# EAGLE schematic PCB Tester Board rev1 (EAGLE 9.6.2)

## Sheet 1 of 5: General
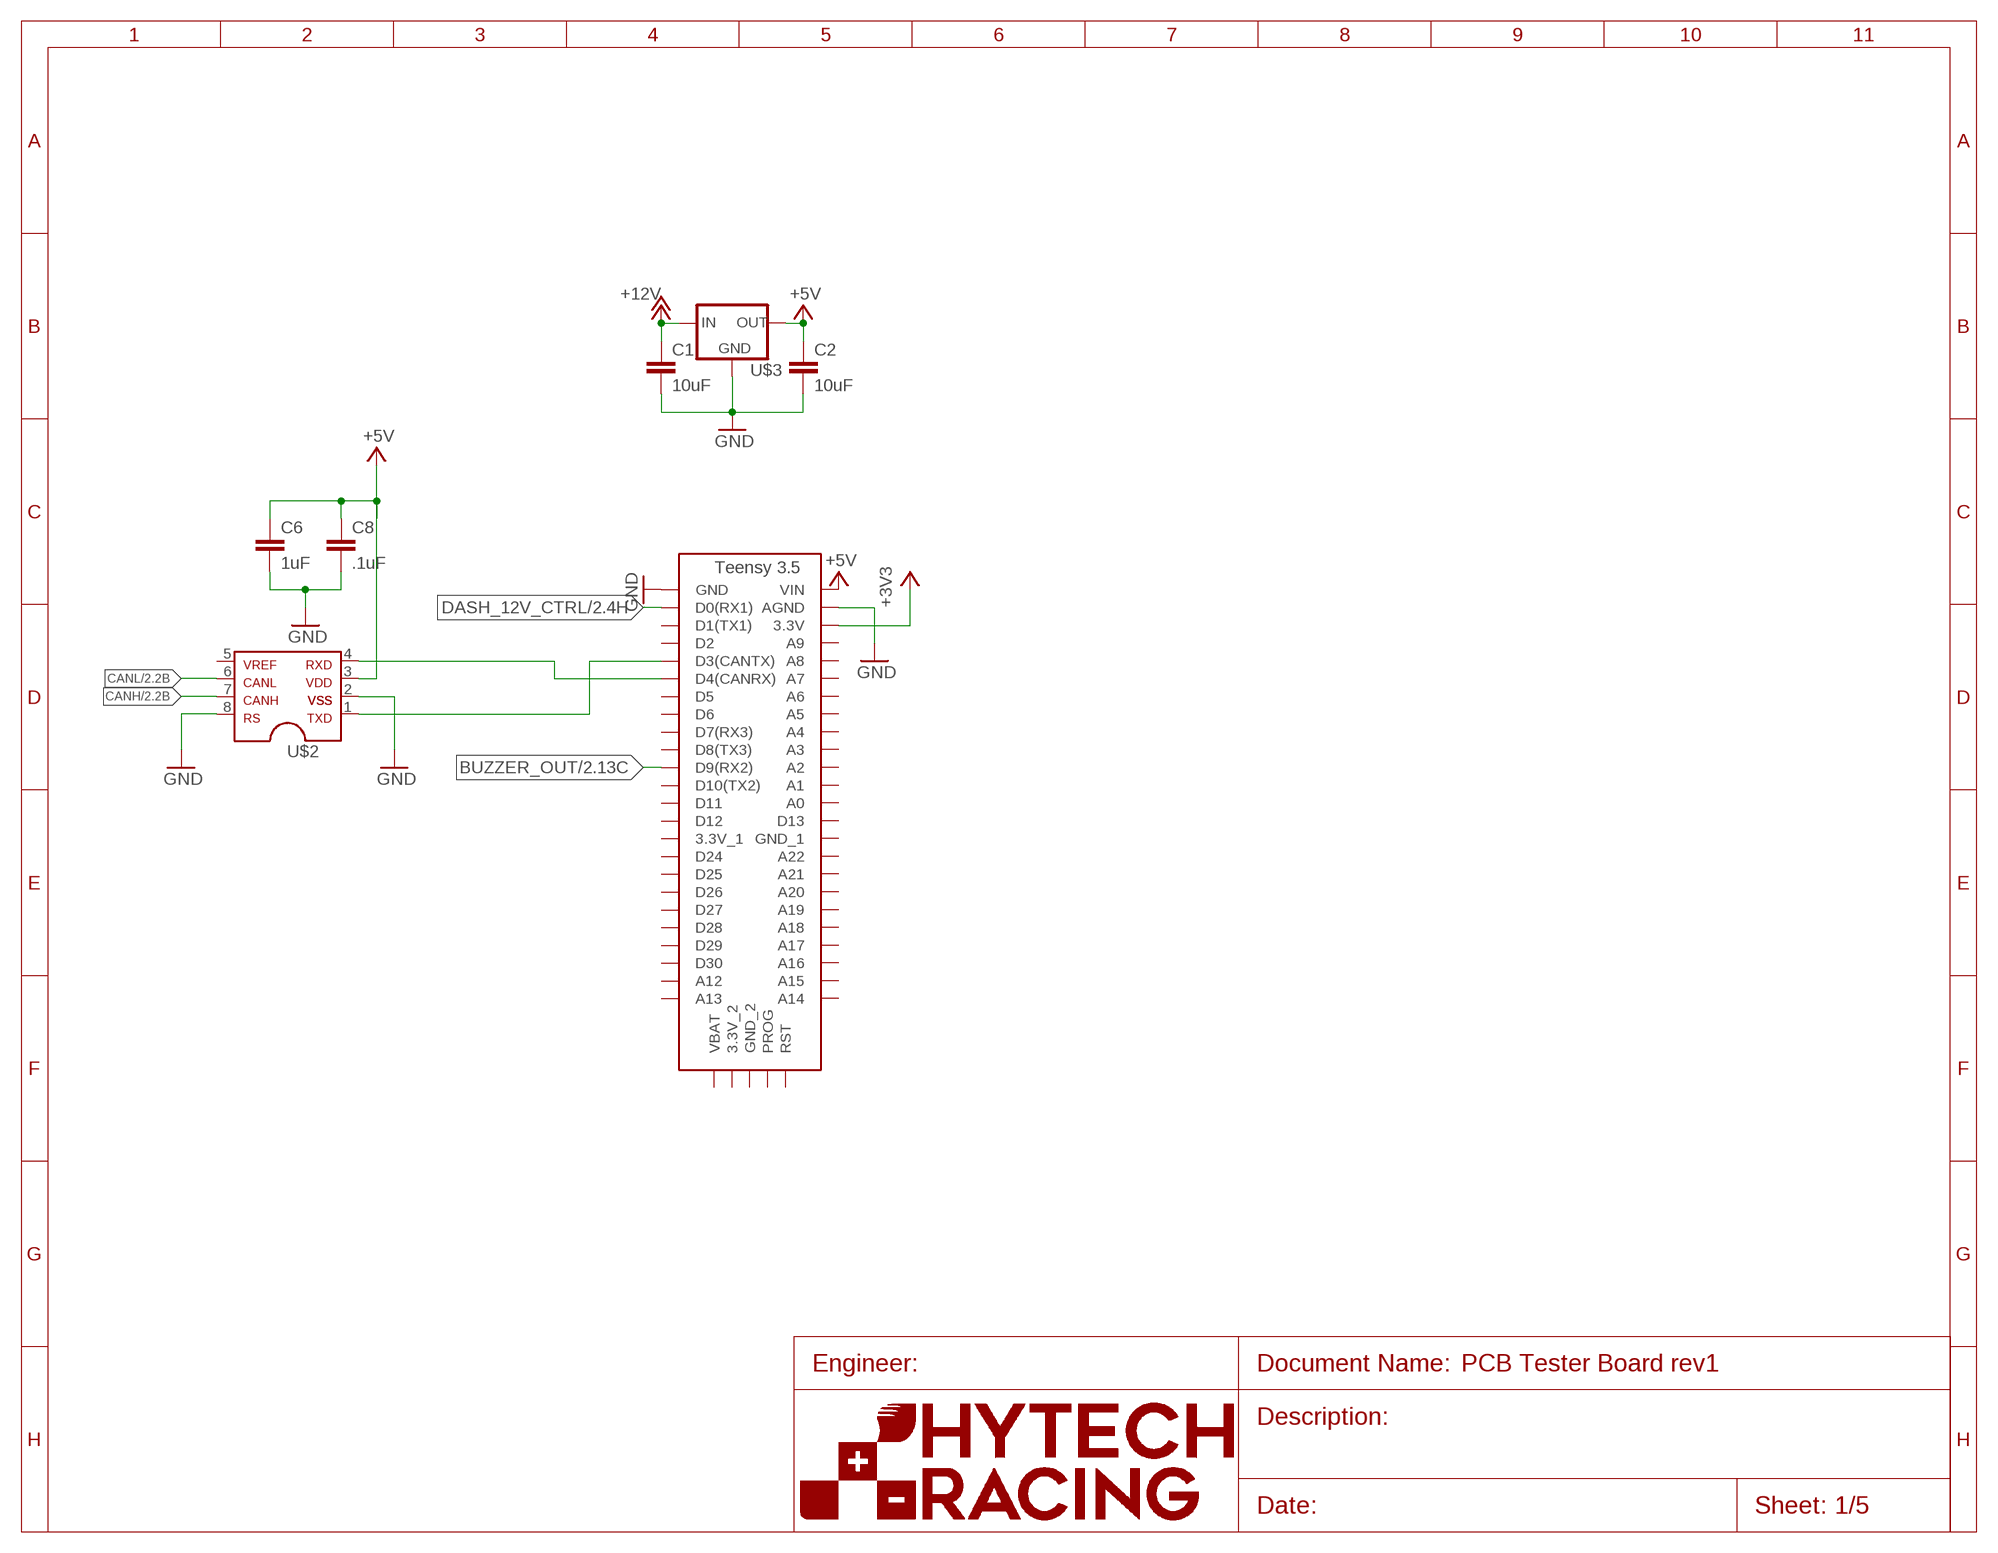
[diagram p0: schematic, sheet 1]
U$17 (FRAME_A): FRAME_DESCRIPTION: Default; ORIENTATION: LANDSCAPE; SIZE: A

### Parts
C1  10uF  CAP0603-CAP  [0603-CAP]
C2  10uF  CAP0603-CAP  [0603-CAP]
C6  1uF  CAP0603-CAP  [0603-CAP]
C8  .1uF  CAP0603-CAP  [0603-CAP]
U$2  MCP2551  [SOIC-08]
U$3  OKI-78SR-5  [OKI-78SR]
U$10  TEENSY_3.5_EXT  [TEENSY_3.5_EXT]

### Nets
+3V3: U$10.3.3V ; also sheet 2,3,4
+5V: C2.1 C6.1 C8.1 U$2.3 U$3.3(OUT) U$10.VIN ; also sheet 3,4
+12V: C1.1 U$3.1(IN) ; also sheet 2,3,4
BUZZER_OUT: U$10.D9(RX2) ; also sheet 2
CANH: U$2.7 ; also sheet 2,4
CANL: U$2.6 ; also sheet 2,4
DASH_12V_CTRL: U$10.D0(RX1) ; also sheet 2
GND: C1.2 C2.2 C6.2 C8.2 U$2.2 U$2.8 U$3.2(GND) U$10.AGND U$10.GND ; also sheet 2,3,4
N$9: U$2.1 U$10.D3(CANTX)
N$10: U$2.4 U$10.D4(CANRX)
Unconnected: U$2.5 U$10.3.3V_1 U$10.3.3V_2 U$10.A0 U$10.A1 U$10.A2 U$10.A3 U$10.A4 U$10.A5 U$10.A6 U$10.A7 U$10.A8 U$10.A9 U$10.A12 U$10.A13 U$10.A14 U$10.A15 U$10.A16 U$10.A17 U$10.A18 U$10.A19 U$10.A20 U$10.A21 U$10.A22 U$10.D1(TX1) U$10.D2 U$10.D5 U$10.D6 U$10.D7(RX3) U$10.D8(TX3) U$10.D10(TX2) U$10.D11 U$10.D12 U$10.D13 U$10.D24 U$10.D25 U$10.D26 U$10.D27 U$10.D28 U$10.D29 U$10.D30 U$10.GND_1 U$10.GND_2 U$10.PROG U$10.RST U$10.VBAT

## Sheet 2 of 5: Dashboard
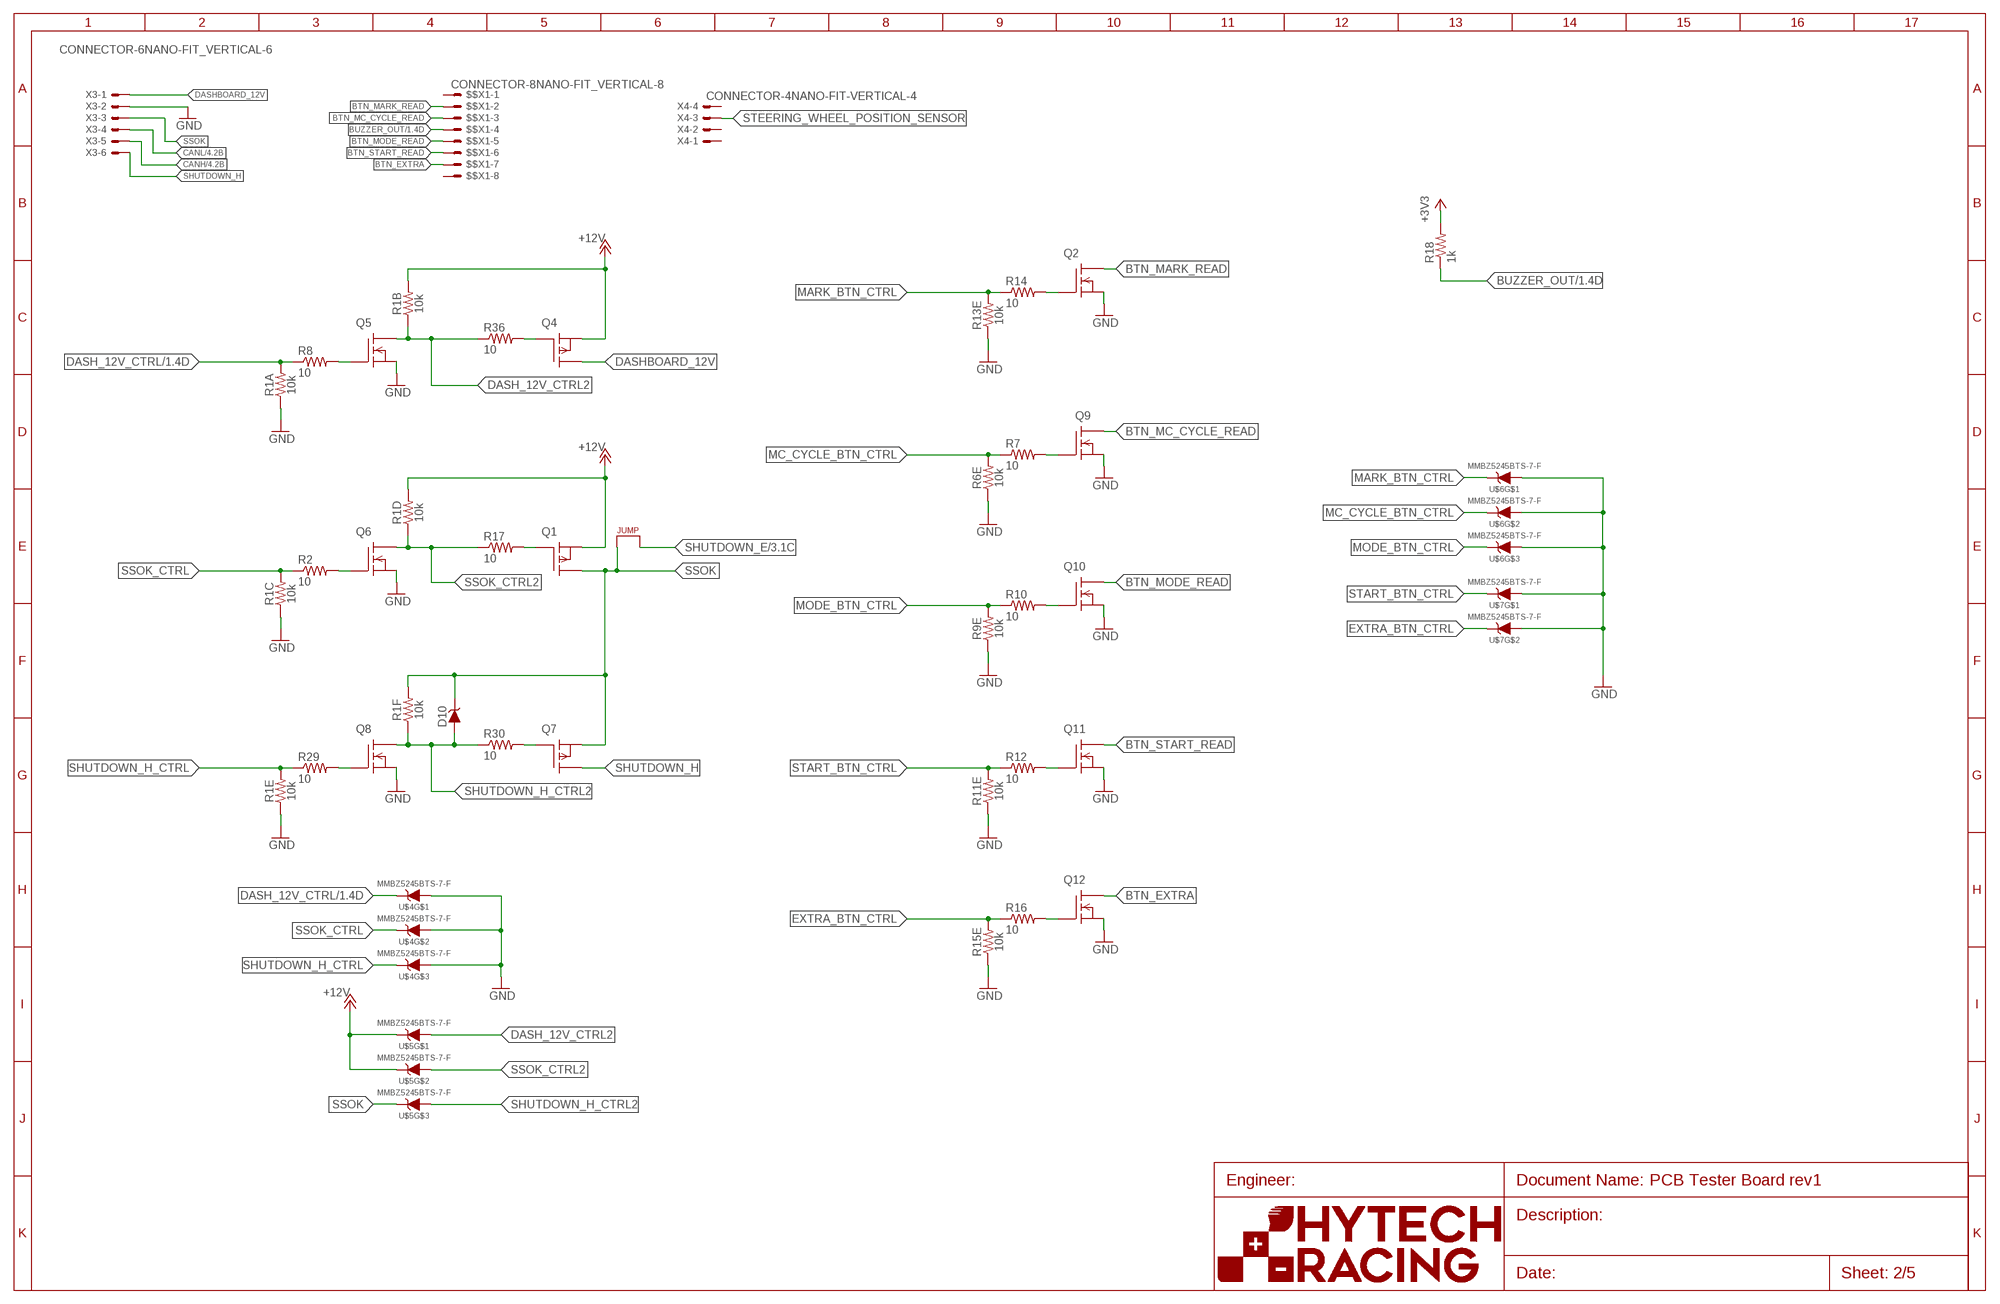
[diagram p1: schematic, sheet 2]
U$14 (FRAME_B): FRAME_DESCRIPTION: Default; ORIENTATION: LANDSCAPE; SIZE: B

### Parts
$$X1  CONNECTOR-8NANO-FIT_VERTICAL-8  [NANO-FIT_VERTICAL-8]
D10  DIODE_ZENER  [SOT23]
J4  JUMPER.1  [1X02]
Q1  P-CHANNEL_MOSFET_DMP3099L-7  [SOT23]
Q2  DMG3406LSOT  [SOT23]
Q4  P-CHANNEL_MOSFET_DMP3099L-7  [SOT23]
Q5  DMG3406LSOT  [SOT23]
Q6  DMG3406LSOT  [SOT23]
Q7  P-CHANNEL_MOSFET_DMP3099L-7  [SOT23]
Q8  DMG3406LSOT  [SOT23]
Q9  DMG3406LSOT  [SOT23]
Q10  DMG3406LSOT  [SOT23]
Q11  DMG3406LSOT  [SOT23]
Q12  DMG3406LSOT  [SOT23]
R1  10k  YC248-JR-0710KL  [YAG_YC248-M]
R2  10  RESISTOR0603  [0603-RES]
R6  10k  YC248-JR-0710KL  [YAG_YC248-M]
R7  10  RESISTOR0603  [0603-RES]
R8  10  RESISTOR0603  [0603-RES]
R9  10k  YC248-JR-0710KL  [YAG_YC248-M]
R10  10  RESISTOR0603  [0603-RES]
R11  10k  YC248-JR-0710KL  [YAG_YC248-M]
R12  10  RESISTOR0603  [0603-RES]
R13  10k  YC248-JR-0710KL  [YAG_YC248-M]
R14  10  RESISTOR0603  [0603-RES]
R15  10k  YC248-JR-0710KL  [YAG_YC248-M]
R16  10  RESISTOR0603  [0603-RES]
R17  10  RESISTOR0603  [0603-RES]
R18  1k  RESISTOR0603  [0603-RES]
R29  10  RESISTOR0603  [0603-RES]
R30  10  RESISTOR0603  [0603-RES]
R36  10  RESISTOR0603  [0603-RES]
U$4  MMBZ5245BTS-7-F  [SOT363]
U$5  MMBZ5245BTS-7-F  [SOT363]
U$6  MMBZ5245BTS-7-F  [SOT363]
U$7  MMBZ5245BTS-7-F  [SOT363]
X3  CONNECTOR-6NANO-FIT_VERTICAL-6  [NANO-FIT_VERTICAL-6]
X4  CONNECTOR-4NANO-FIT-VERTICAL-4  [NANO-FIT_VERTICAL-4]

### Nets
+3V3: R18.2 ; also sheet 1,3,4
+12V: Q1.2(S) Q4.2(S) R1.13 R1.15 U$5.P$4(C) U$5.P$5(C) ; also sheet 1,3,4
BTN_EXTRA: $$X1.P$7 Q12.3(D)
BTN_MARK_READ: $$X1.P$2 Q2.3(D)
BTN_MC_CYCLE_READ: $$X1.P$3 Q9.3(D)
BTN_MODE_READ: $$X1.P$5 Q10.3(D)
BTN_START_READ: $$X1.P$6 Q11.3(D)
BUZZER_OUT: $$X1.P$4 R18.1 ; also sheet 1
CANH: X3.P$5 ; also sheet 1,4
CANL: X3.P$4 ; also sheet 1,4
DASH_12V_CTRL: R1.16 R8.1 U$4.P$4(C) ; also sheet 1
DASH_12V_CTRL2: Q5.3(D) R1.2 R36.1 U$5.P$1(A)
DASHBOARD_12V: Q4.3(D) X3.P$1
EXTRA_BTN_CTRL: R15.12 R16.1 U$7.P$5(C)
GND: Q2.2(S) Q5.2(S) Q6.2(S) Q8.2(S) Q9.2(S) Q10.2(S) Q11.2(S) Q12.2(S) R1.1 R1.3 R1.5 R6.5 R9.5 R11.5 R13.5 R15.5 U$4.P$1(A) U$4.P$2(A) U$4.P$3(A) U$6.P$1(A) U$6.P$2(A) U$6.P$3(A) U$7.P$1(A) U$7.P$2(A) X3.P$2 ; also sheet 1,3,4
MARK_BTN_CTRL: R13.12 R14.1 U$6.P$4(C)
MC_CYCLE_BTN_CTRL: R6.12 R7.1 U$6.P$5(C)
MODE_BTN_CTRL: R9.12 R10.1 U$6.P$6(C)
N$4: Q9.1(G) R7.2
N$5: Q10.1(G) R10.2
N$6: Q11.1(G) R12.2
N$7: Q5.1(G) R8.2
N$8: Q12.1(G) R16.2
N$13: Q2.1(G) R14.2
N$26: Q6.1(G) R2.2
N$27: Q1.1(G) R17.2
N$29: Q8.1(G) R29.2
N$30: Q7.1(G) R30.2
N$34: Q4.1(G) R36.2
SHUTDOWN_E: J4.2 ; also sheet 3
SHUTDOWN_H: Q7.3(D) X3.P$6
SHUTDOWN_H_CTRL: R1.12 R29.1 U$4.P$6(C)
SHUTDOWN_H_CTRL2: D10.1(A) Q8.3(D) R1.6 R30.1 U$5.P$3(A)
SSOK: D10.3(C) J4.1 Q1.3(D) Q7.2(S) R1.11 U$5.P$6(C) X3.P$3
SSOK_CTRL: R1.14 R2.1 U$4.P$5(C)
SSOK_CTRL2: Q6.3(D) R1.4 R17.1 U$5.P$2(A)
START_BTN_CTRL: R11.12 R12.1 U$7.P$4(C)
STEERING_WHEEL_POSITION_SENSOR: X4.P$3
Unconnected: $$X1.P$1 $$X1.P$8 R1.7 R1.8 R1.9 R1.10 R6.1 R6.2 R6.3 R6.4 R6.6 R6.7 R6.8 R6.9 R6.10 R6.11 R6.13 R6.14 R6.15 R6.16 R9.1 R9.2 R9.3 R9.4 R9.6 R9.7 R9.8 R9.9 R9.10 R9.11 R9.13 R9.14 R9.15 R9.16 R11.1 R11.2 R11.3 R11.4 R11.6 R11.7 R11.8 R11.9 R11.10 R11.11 R11.13 R11.14 R11.15 R11.16 R13.1 R13.2 R13.3 R13.4 R13.6 R13.7 R13.8 R13.9 R13.10 R13.11 R13.13 R13.14 R13.15 R13.16 R15.1 R15.2 R15.3 R15.4 R15.6 R15.7 R15.8 R15.9 R15.10 R15.11 R15.13 R15.14 R15.15 R15.16 U$7.P$3(A) U$7.P$6(C) X4.P$1 X4.P$2 X4.P$4

## Sheet 3 of 5: Main ECU Sheet
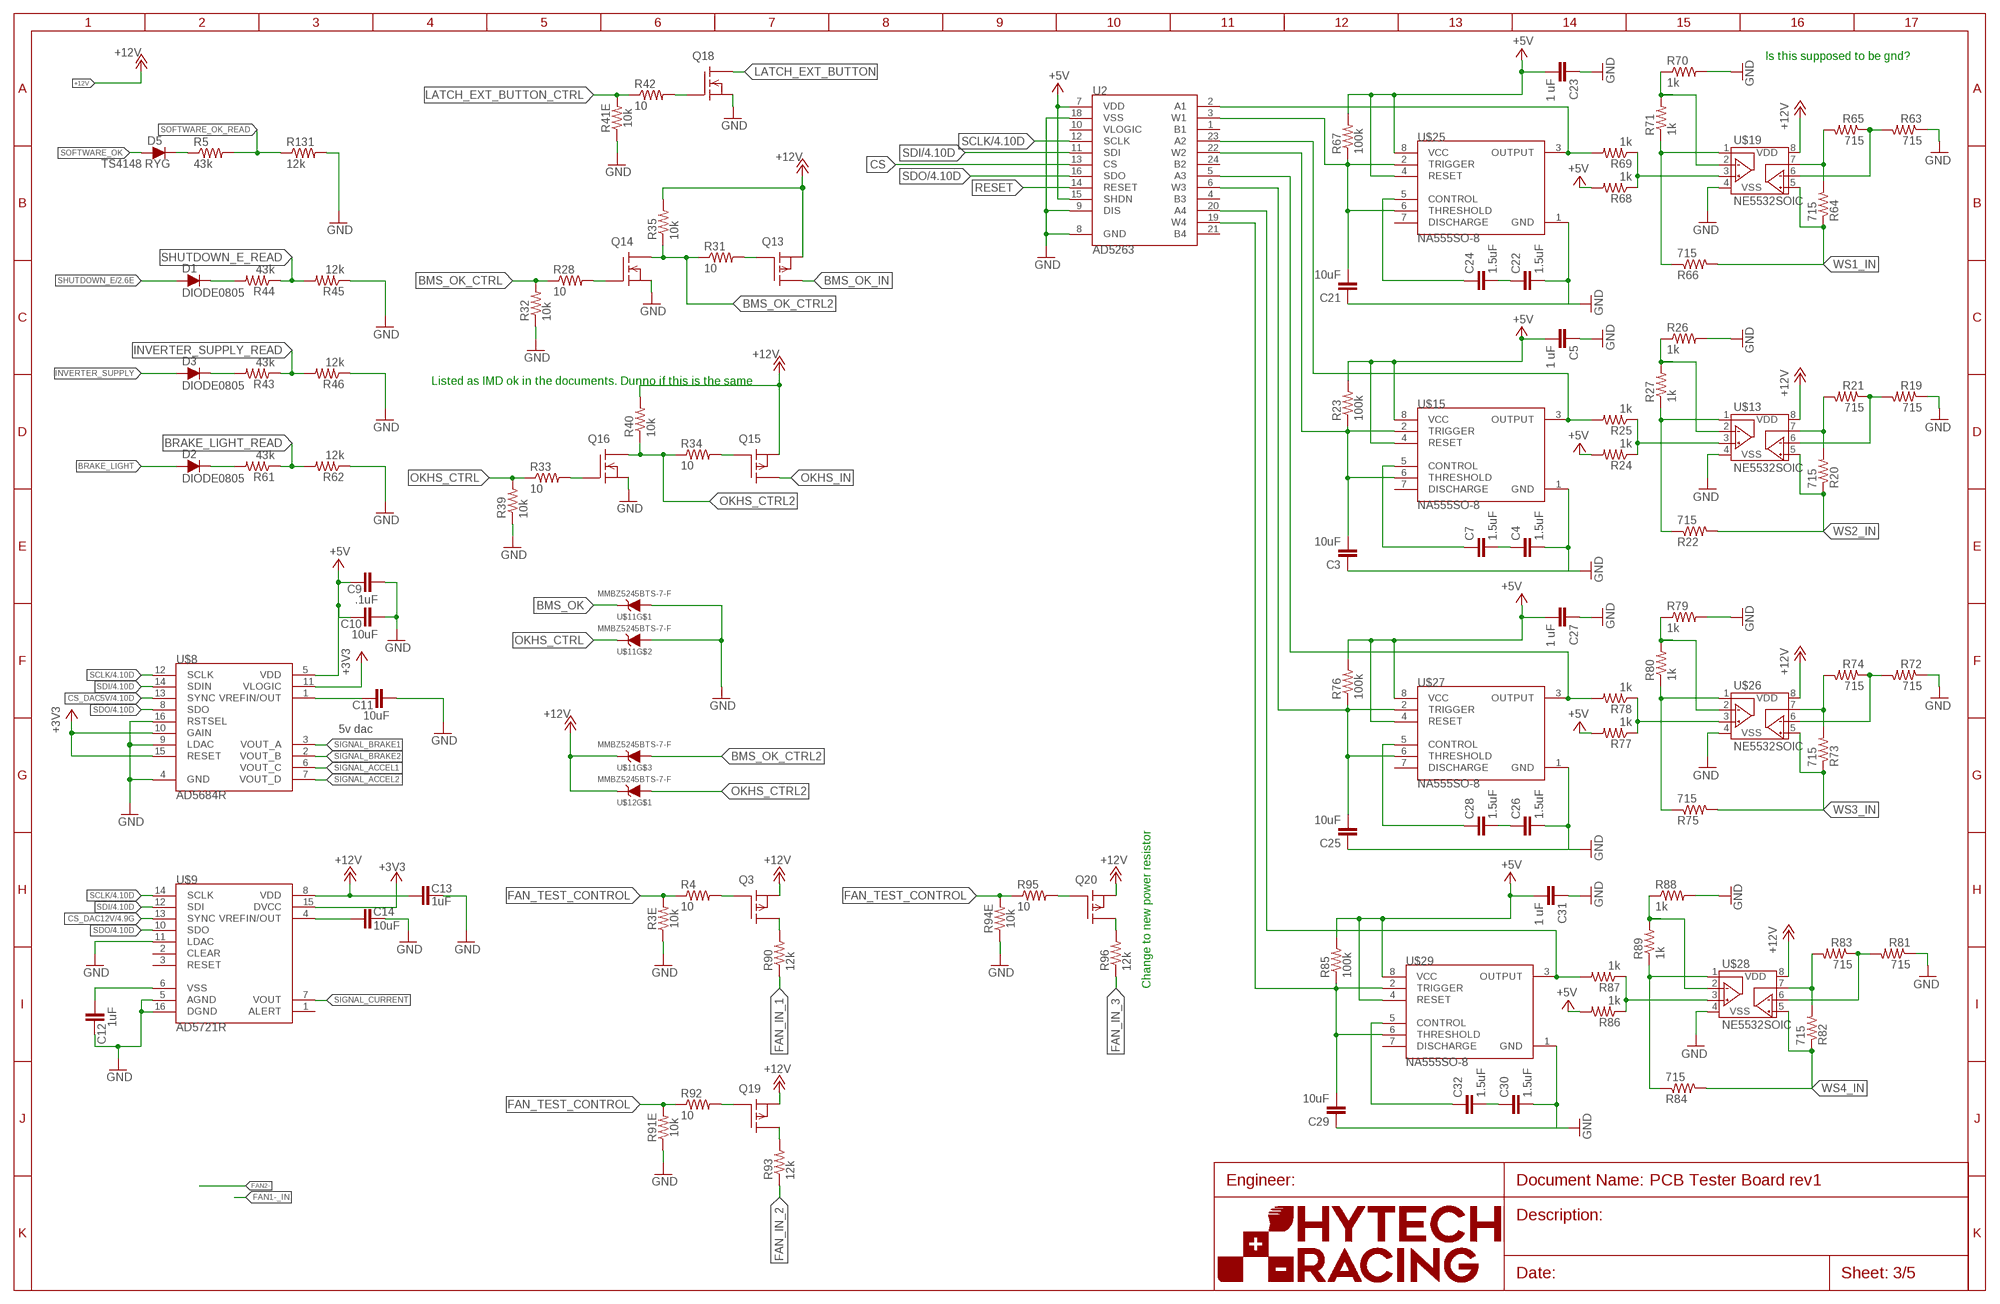
[diagram p2: schematic, sheet 3]
U$1 (FRAME_B): FRAME_DESCRIPTION: Default; ORIENTATION: LANDSCAPE; SIZE: B

### Parts
C3  10uF  CAP0603-CAP  [0603-CAP]
C4  1.5uF  CAP0603-CAP  [0603-CAP]
C5  1 uF  CAP0603-CAP  [0603-CAP]
C7  1.5uF  CAP0603-CAP  [0603-CAP]
C9  .1uF  CAP0603-CAP  [0603-CAP]
C10  10uF  CAP0603-CAP  [0603-CAP]
C11  10uF  CAP0603-CAP  [0603-CAP]
C12  1uF  CAP0603-CAP  [0603-CAP]
C13  1uF  CAP0603-CAP  [0603-CAP]
C14  10uF  CAP0603-CAP  [0603-CAP]
C21  10uF  CAP0603-CAP  [0603-CAP]
C22  1.5uF  CAP0603-CAP  [0603-CAP]
C23  1 uF  CAP0603-CAP  [0603-CAP]
C24  1.5uF  CAP0603-CAP  [0603-CAP]
C25  10uF  CAP0603-CAP  [0603-CAP]
C26  1.5uF  CAP0603-CAP  [0603-CAP]
C27  1 uF  CAP0603-CAP  [0603-CAP]
C28  1.5uF  CAP0603-CAP  [0603-CAP]
C29  10uF  CAP0603-CAP  [0603-CAP]
C30  1.5uF  CAP0603-CAP  [0603-CAP]
C31  1 uF  CAP0603-CAP  [0603-CAP]
C32  1.5uF  CAP0603-CAP  [0603-CAP]
D1  DIODE0805  [0805_D]
D2  DIODE0805  [0805_D]
D3  DIODE0805  [0805_D]
D5  TS4148 RYG  DIODE0805  [0805_D]
Q3  P-CHANNEL_MOSFET_DMP3099L-7  [SOT23]
Q13  P-CHANNEL_MOSFET_DMP3099L-7  [SOT23]
Q14  DMG3406LSOT  [SOT23]
Q15  P-CHANNEL_MOSFET_DMP3099L-7  [SOT23]
Q16  DMG3406LSOT  [SOT23]
Q18  DMG3406LSOT  [SOT23]
Q19  P-CHANNEL_MOSFET_DMP3099L-7  [SOT23]
Q20  P-CHANNEL_MOSFET_DMP3099L-7  [SOT23]
R3  10k  YC248-JR-0710KL  [YAG_YC248-M]
R4  10  RESISTOR0603  [0603-RES]
R5  43k  RESISTOR0603  [0603-RES]
R19  715  RESISTOR0603  [0603-RES]
R20  715  RESISTOR0603  [0603-RES]
R21  715  RESISTOR0603  [0603-RES]
R22  715  RESISTOR0603  [0603-RES]
R23  100k  RESISTOR0603  [0603-RES]
R24  1k  RESISTOR0603  [0603-RES]
R25  1k  RESISTOR0603  [0603-RES]
R26  1k  RESISTOR0603  [0603-RES]
R27  1k  RESISTOR0603  [0603-RES]
R28  10  RESISTOR0603  [0603-RES]
R31  10  RESISTOR0603  [0603-RES]
R32  10k  RESISTOR0603  [0603-RES]
R33  10  RESISTOR0603  [0603-RES]
R34  10  RESISTOR0603  [0603-RES]
R35  10k  RESISTOR0603  [0603-RES]
R39  10k  RESISTOR0603  [0603-RES]
R40  10k  RESISTOR0603  [0603-RES]
R41  10k  YC248-JR-0710KL  [YAG_YC248-M]
R42  10  RESISTOR0603  [0603-RES]
R43  43k  RESISTOR0603  [0603-RES]
R44  43k  RESISTOR0603  [0603-RES]
R45  12k  RESISTOR0603  [0603-RES]
R46  12k  RESISTOR0603  [0603-RES]
R61  43k  RESISTOR0603  [0603-RES]
R62  12k  RESISTOR0603  [0603-RES]
R63  715  RESISTOR0603  [0603-RES]
R64  715  RESISTOR0603  [0603-RES]
R65  715  RESISTOR0603  [0603-RES]
R66  715  RESISTOR0603  [0603-RES]
R67  100k  RESISTOR0603  [0603-RES]
R68  1k  RESISTOR0603  [0603-RES]
R69  1k  RESISTOR0603  [0603-RES]
R70  1k  RESISTOR0603  [0603-RES]
R71  1k  RESISTOR0603  [0603-RES]
R72  715  RESISTOR0603  [0603-RES]
R73  715  RESISTOR0603  [0603-RES]
R74  715  RESISTOR0603  [0603-RES]
R75  715  RESISTOR0603  [0603-RES]
R76  100k  RESISTOR0603  [0603-RES]
R77  1k  RESISTOR0603  [0603-RES]
R78  1k  RESISTOR0603  [0603-RES]
R79  1k  RESISTOR0603  [0603-RES]
R80  1k  RESISTOR0603  [0603-RES]
R81  715  RESISTOR0603  [0603-RES]
R82  715  RESISTOR0603  [0603-RES]
R83  715  RESISTOR0603  [0603-RES]
R84  715  RESISTOR0603  [0603-RES]
R85  100k  RESISTOR0603  [0603-RES]
R86  1k  RESISTOR0603  [0603-RES]
R87  1k  RESISTOR0603  [0603-RES]
R88  1k  RESISTOR0603  [0603-RES]
R89  1k  RESISTOR0603  [0603-RES]
R90  12k  RESISTOR10W  [10W_RESISTOR_VISHAY]
R91  10k  YC248-JR-0710KL  [YAG_YC248-M]
R92  10  RESISTOR0603  [0603-RES]
R93  12k  RESISTOR10W  [10W_RESISTOR_VISHAY]
R94  10k  YC248-JR-0710KL  [YAG_YC248-M]
R95  10  RESISTOR0603  [0603-RES]
R96  12k  RESISTOR10W  [10W_RESISTOR_VISHAY]
R131  12k  RESISTOR0603  [0603-RES]
U2  AD5263  [TSSOP-24]
U$8  AD5684R  [TSSOP-16]
U$9  AD5721R  [TSSOP-16]
U$11  MMBZ5245BTS-7-F  [SOT363]
U$12  MMBZ5245BTS-7-F  [SOT363]
U$13  NE5532SOIC  [SOIC-08]
U$15  NA555SO-8  [SOIC-08]
U$19  NE5532SOIC  [SOIC-08]
U$25  NA555SO-8  [SOIC-08]
U$26  NE5532SOIC  [SOIC-08]
U$27  NA555SO-8  [SOIC-08]
U$28  NE5532SOIC  [SOIC-08]
U$29  NA555SO-8  [SOIC-08]

### Nets
555_GND: C3.1 C4.2 C21.1 C22.2 C25.1 C26.2 C29.1 C30.2 U$15.1(GND) U$25.1(GND) U$27.1(GND) U$29.1(GND) ; supply symbol labelled GND
+3V3: U$8.10(GAIN) U$8.11(VLOGIC) U$8.15(RESET) U$9.15(DVCC) ; also sheet 1,2,4
+5V: C5.2 C9.1 C10.1 C23.2 C27.2 C31.2 R23.2 R24.2 R67.2 R68.2 R76.2 R77.2 R85.2 R86.2 U2.7(VDD) U2.15(SHDN) U$8.5(VDD) U$15.4(RESET) U$15.8(VCC) U$25.4(RESET) U$25.8(VCC) U$27.4(RESET) U$27.8(VCC) U$29.4(RESET) U$29.8(VCC) ; also sheet 1,4
+12V: C13.2 Q3.2(S) Q13.2(S) Q15.2(S) Q19.2(S) Q20.2(S) R35.2 R40.2 U$9.8(VDD) U$11.P$6(C) U$12.P$4(C) U$13.8(VDD) U$19.8(VDD) U$26.8(VDD) U$28.8(VDD) ; also sheet 1,2,4
ALTERNATINGVOLTAGE1: R66.1 R71.1 U$19.1(VOUTA)
ALTERNATINGVOLTAGE2: R22.1 R27.1 U$13.1(VOUTA)
ALTERNATINGVOLTAGE3: R75.1 R80.1 U$26.1(VOUTA)
ALTERNATINGVOLTAGE4: R84.1 R89.1 U$28.1(VOUTA)
BMS_OK: U$11.P$4(C)
BMS_OK_CTRL: R28.1 R32.2
BMS_OK_CTRL2: Q14.3(D) R31.1 R35.1 U$11.P$3(A)
BMS_OK_IN: Q13.3(D)
BRAKE_LIGHT: D2.A
BRAKE_LIGHT_READ: R61.1 R62.2
CS: U2.13(CS)
CS_DAC5V: U$8.13(SYNC) ; also sheet 4
CS_DAC12V: U$9.13(SYNC) ; also sheet 4
FAN_IN_1: R90.1
FAN_IN_2: R93.1
FAN_IN_3: R96.1
FAN_TEST_CONTROL: R3.12 R4.1 R91.12 R92.1 R94.12 R95.1
GND: C5.1 C9.2 C10.2 C11.2 C12.1 C13.1 C14.1 C23.1 C27.1 C31.1 Q14.2(S) Q16.2(S) Q18.2(S) R3.5 R19.1 R26.2 R32.1 R39.1 R41.5 R45.1 R46.1 R62.1 R63.1 R70.2 R72.1 R79.2 R81.1 R88.2 R91.5 R94.5 R131.2 U2.8(GND) U2.9(DIS) U2.18(VSS) U$8.4(GND) U$8.9(LDAC) U$8.16(RSTSEL) U$9.5(AGND) U$9.11(LDAC) U$9.16(DGND) U$11.P$1(A) U$11.P$2(A) U$13.4(VSS) U$19.4(VSS) U$26.4(VSS) U$28.4(VSS) ; also sheet 1,2,4
INVERTER_SUPPLY: D3.A
INVERTER_SUPPLY_READ: R43.1 R46.2
LATCH_EXT_BUTTON: Q18.3(D)
LATCH_EXT_BUTTON_CTRL: R41.12 R42.1
N$1: Q3.1(G) R4.2
N$2: C11.1 U$8.1(VREFIN/OUT)
N$3: D5.C R5.1
N$11: Q14.1(G) R28.2
N$12: Q13.1(G) R31.2
N$14: Q16.1(G) R33.2
N$15: Q15.1(G) R34.2
N$16: C12.2 U$9.6(VSS)
N$17: R69.2 U2.2(A1) U$25.3(OUTPUT)
N$18: R25.2 U2.23(A2) U$15.3(OUTPUT)
N$19: R24.1 R25.1 U$13.3(VINA+)
N$20: R20.2 R21.2 U$13.7(VOUTB)
N$21: R26.1 R27.2 U$13.2(VINA-)
N$22: C3.2 R23.1 U2.22(W2) U$15.2(TRIGGER) U$15.6(THRESHOLD)
N$23: C7.1 U$15.5(CONTROL)
N$25: C14.2 U$9.4(VREFIN/OUT)
N$28: C4.1 C7.2
N$33: R19.2 R21.1 U$13.6(VINB-)
N$51: D3.C R43.2
N$52: D1.C R44.2
N$53: D2.C R61.2
N$54: Q18.1(G) R42.2
N$55: R68.1 R69.1 U$19.3(VINA+)
N$56: R64.2 R65.2 U$19.7(VOUTB)
N$57: R70.1 R71.2 U$19.2(VINA-)
N$58: C21.2 R67.1 U2.3(W1) U$25.2(TRIGGER) U$25.6(THRESHOLD)
N$59: C24.1 U$25.5(CONTROL)
N$60: C22.1 C24.2
N$61: R63.2 R65.1 U$19.6(VINB-)
N$62: R78.2 U2.5(A3) U$27.3(OUTPUT)
N$63: R77.1 R78.1 U$26.3(VINA+)
N$64: R73.2 R74.2 U$26.7(VOUTB)
N$65: R79.1 R80.2 U$26.2(VINA-)
N$66: Q3.3(D) R90.2
N$67: C28.1 U$27.5(CONTROL)
N$68: C26.1 C28.2
N$69: R72.2 R74.1 U$26.6(VINB-)
N$70: R87.2 U2.20(A4) U$29.3(OUTPUT)
N$71: R86.1 R87.1 U$28.3(VINA+)
N$72: R82.2 R83.2 U$28.7(VOUTB)
N$73: R88.1 R89.2 U$28.2(VINA-)
N$74: C29.2 R85.1 U2.19(W4) U$29.2(TRIGGER) U$29.6(THRESHOLD)
N$75: C32.1 U$29.5(CONTROL)
N$76: C30.1 C32.2
N$77: R81.2 R83.1 U$28.6(VINB-)
N$78: Q19.1(G) R92.2
N$79: Q19.3(D) R93.2
N$80: Q20.1(G) R95.2
N$81: Q20.3(D) R96.2
N$82: C25.2 R76.1 U2.6(W3) U$27.2(TRIGGER) U$27.6(THRESHOLD)
OKHS_CTRL: R33.1 R39.2 U$11.P$5(C)
OKHS_CTRL2: Q16.3(D) R34.1 R40.1 U$12.P$1(A)
OKHS_IN: Q15.3(D)
RESET: U2.14(RESET)
SCLK: U2.12(SCLK) U$8.12(SCLK) U$9.14(SCLK) ; also sheet 4
SDI: U2.11(SDI) U$8.14(SDIN) U$9.12(SDI) ; also sheet 4
SDO: U2.16(SDO) U$8.8(SDO) U$9.10(SDO) ; also sheet 4
SHUTDOWN_E: D1.A ; also sheet 2
SHUTDOWN_E_READ: R44.1 R45.2
SIGNAL_ACCEL1: U$8.6(VOUT_C)
SIGNAL_ACCEL2: U$8.7(VOUT_D)
SIGNAL_BRAKE1: U$8.3(VOUT_A)
SIGNAL_BRAKE2: U$8.2(VOUT_B)
SIGNAL_CURRENT: U$9.7(VOUT)
SOFTWARE_OK: D5.A
SOFTWARE_OK_READ: R5.2 R131.1
WS1_IN: R64.1 R66.2 U$19.5(VINB+)
WS2_IN: R20.1 R22.2 U$13.5(VINB+)
WS3_IN: R73.1 R75.2 U$26.5(VINB+)
WS4_IN: R82.1 R84.2 U$28.5(VINB+)
Unconnected: R3.1 R3.2 R3.3 R3.4 R3.6 R3.7 R3.8 R3.9 R3.10 R3.11 R3.13 R3.14 R3.15 R3.16 R41.1 R41.2 R41.3 R41.4 R41.6 R41.7 R41.8 R41.9 R41.10 R41.11 R41.13 R41.14 R41.15 R41.16 R91.1 R91.2 R91.3 R91.4 R91.6 R91.7 R91.8 R91.9 R91.10 R91.11 R91.13 R91.14 R91.15 R91.16 R94.1 R94.2 R94.3 R94.4 R94.6 R94.7 R94.8 R94.9 R94.10 R94.11 R94.13 R94.14 R94.15 R94.16 U2.1(B1) U2.4(B3) U2.10(VLOGIC) U2.21(B4) U2.24(B2) U$9.1(ALERT) U$9.2(CLEAR) U$9.3(RESET) U$12.P$2(A) U$12.P$3(A) U$12.P$5(C) U$12.P$6(C) U$15.7(DISCHARGE) U$25.7(DISCHARGE) U$27.7(DISCHARGE) U$29.7(DISCHARGE)

### Notes on the sheet
- Is this supposed to be gnd?
- Listed as IMD ok in the documents. Dunno if this is the same
- 5v dac
- Change to new power resistor

## Sheet 4 of 5: HV Board SHeet
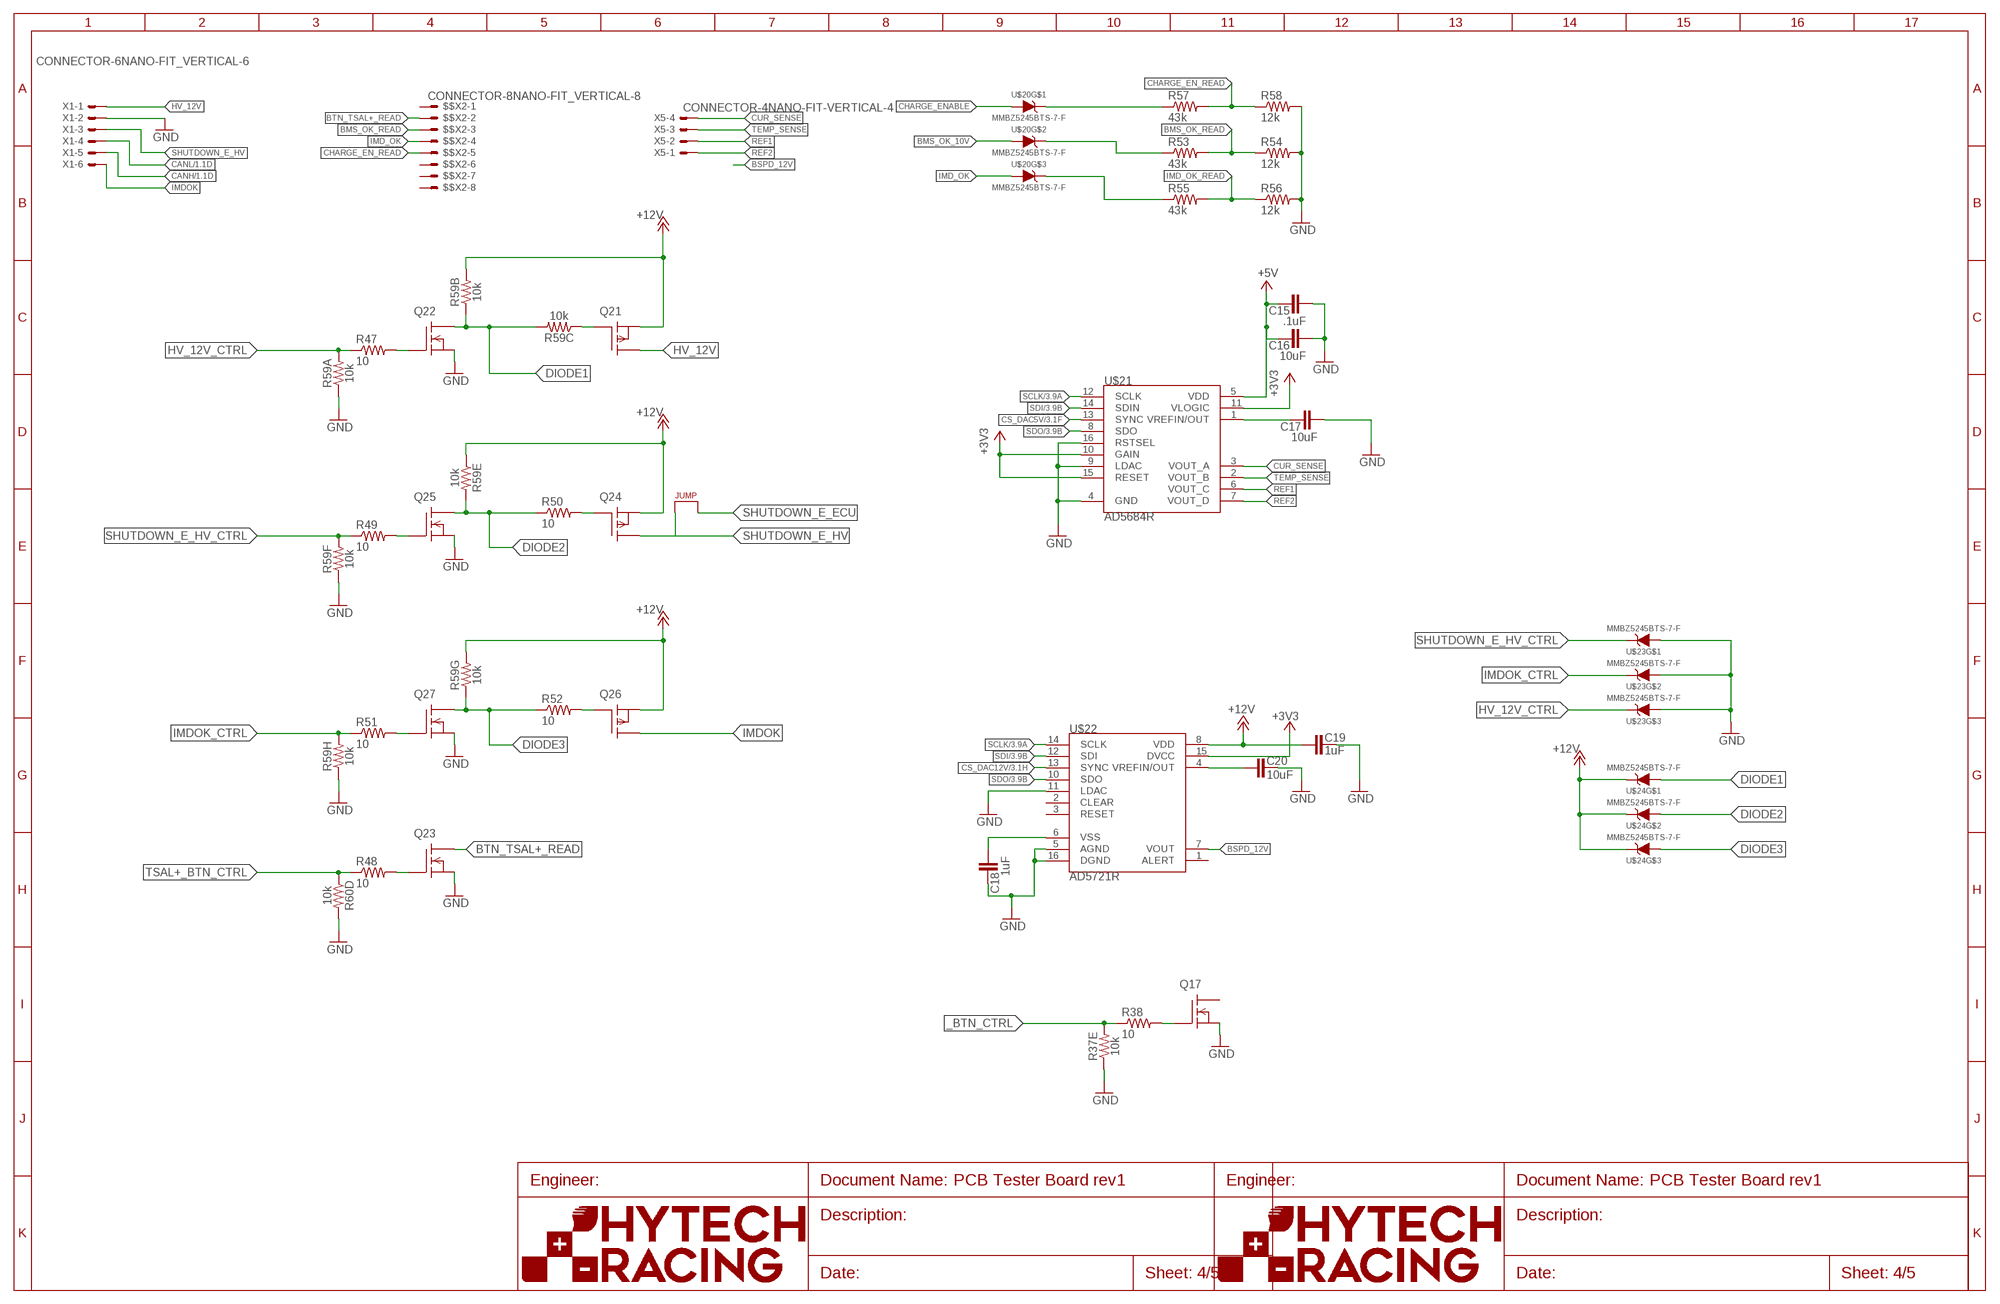
[diagram p3: schematic, sheet 4]
U$16 (FRAME_A): FRAME_DESCRIPTION: Default; ORIENTATION: LANDSCAPE; SIZE: A
U$18 (FRAME_B): FRAME_DESCRIPTION: Default; ORIENTATION: LANDSCAPE; SIZE: B

### Parts
$$X2  CONNECTOR-8NANO-FIT_VERTICAL-8  [NANO-FIT_VERTICAL-8]
C15  .1uF  CAP0603-CAP  [0603-CAP]
C16  10uF  CAP0603-CAP  [0603-CAP]
C17  10uF  CAP0603-CAP  [0603-CAP]
C18  1uF  CAP0603-CAP  [0603-CAP]
C19  1uF  CAP0603-CAP  [0603-CAP]
C20  10uF  CAP0603-CAP  [0603-CAP]
J1  JUMPER.1  [1X02]
Q17  DMG3406LSOT  [SOT23]
Q21  P-CHANNEL_MOSFET_DMP3099L-7  [SOT23]
Q22  DMG3406LSOT  [SOT23]
Q23  DMG3406LSOT  [SOT23]
Q24  P-CHANNEL_MOSFET_DMP3099L-7  [SOT23]
Q25  DMG3406LSOT  [SOT23]
Q26  P-CHANNEL_MOSFET_DMP3099L-7  [SOT23]
Q27  DMG3406LSOT  [SOT23]
R37  10k  YC248-JR-0710KL  [YAG_YC248-M]
R38  10  RESISTOR0603  [0603-RES]
R47  10  RESISTOR0603  [0603-RES]
R48  10  RESISTOR0603  [0603-RES]
R49  10  RESISTOR0603  [0603-RES]
R50  10  RESISTOR0603  [0603-RES]
R51  10  RESISTOR0603  [0603-RES]
R52  10  RESISTOR0603  [0603-RES]
R53  43k  RESISTOR0603  [0603-RES]
R54  12k  RESISTOR0603  [0603-RES]
R55  43k  RESISTOR0603  [0603-RES]
R56  12k  RESISTOR0603  [0603-RES]
R57  43k  RESISTOR0603  [0603-RES]
R58  12k  RESISTOR0603  [0603-RES]
R59  10k  YC248-JR-0710KL  [YAG_YC248-M]
R60  10k  YC248-JR-0710KL  [YAG_YC248-M]
U$20  MMBZ5245BTS-7-F  [SOT363]
U$21  AD5684R  [TSSOP-16]
U$22  AD5721R  [TSSOP-16]
U$23  MMBZ5245BTS-7-F  [SOT363]
U$24  MMBZ5245BTS-7-F  [SOT363]
X1  CONNECTOR-6NANO-FIT_VERTICAL-6  [NANO-FIT_VERTICAL-6]
X5  CONNECTOR-4NANO-FIT-VERTICAL-4  [NANO-FIT_VERTICAL-4]

### Nets
+3V3: U$21.10(GAIN) U$21.11(VLOGIC) U$21.15(RESET) U$22.15(DVCC) ; also sheet 1,2,3
+5V: C15.1 C16.1 U$21.5(VDD) ; also sheet 1,3
+12V: C19.2 Q21.2(S) Q24.2(S) Q26.2(S) R59.5 R59.10 R59.15 U$22.8(VDD) U$24.P$4(C) U$24.P$5(C) U$24.P$6(C) ; also sheet 1,2,3
_BTN_CTRL: R37.12 R38.1
BMS_OK_10V: U$20.P$2(A)
BMS_OK_READ: R53.2 R54.1
BSPD_12V: U$22.7(VOUT)
BTN_TSAL+_READ: $$X2.P$2 Q23.3(D)
CANH: X1.P$5 ; also sheet 1,2
CANL: X1.P$4 ; also sheet 1,2
CHARGE_EN_READ: R57.2 R58.1
CHARGE_ENABLE: U$20.P$1(A)
CS_DAC5V: U$21.13(SYNC) ; also sheet 3
CS_DAC12V: U$22.13(SYNC) ; also sheet 3
CUR_SENSE: U$21.3(VOUT_A) X5.P$4
DIODE1: Q22.3(D) R59.2 R59.14 U$24.P$1(A)
DIODE2: Q25.3(D) R50.1 R59.12 U$24.P$2(A)
DIODE3: Q27.3(D) R52.1 R59.7 U$24.P$3(A)
GND: C15.2 C16.2 C17.2 C18.1 C19.1 C20.1 Q17.2(S) Q22.2(S) Q23.2(S) Q25.2(S) Q27.2(S) R37.5 R54.2 R56.2 R58.2 R59.1 R59.6 R59.8 R60.13 U$21.4(GND) U$21.9(LDAC) U$21.16(RSTSEL) U$22.5(AGND) U$22.11(LDAC) U$22.16(DGND) U$23.P$1(A) U$23.P$2(A) U$23.P$3(A) X1.P$2 ; also sheet 1,2,3
HV_12V: Q21.3(D) X1.P$1
HV_12V_CTRL: R47.1 R59.16 U$23.P$6(C)
IMD_OK: U$20.P$3(A)
IMD_OK_READ: R55.2 R56.1
IMDOK: Q26.3(D) X1.P$6
IMDOK_CTRL: R51.1 R59.9 U$23.P$5(C)
N$24: Q17.1(G) R38.2
N$32: Q22.1(G) R47.2
N$35: Q21.1(G) R59.3
N$36: Q23.1(G) R48.2
N$37: Q25.1(G) R49.2
N$38: Q24.1(G) R50.2
N$39: Q27.1(G) R51.2
N$40: Q26.1(G) R52.2
N$41: R57.1 U$20.P$4(C)
N$42: $$X2.P$3
N$43: R53.1 U$20.P$5(C)
N$44: $$X2.P$4
N$45: R55.1 U$20.P$6(C)
N$46: $$X2.P$5
N$47: C17.1 U$21.1(VREFIN/OUT)
N$48: C20.2 U$22.4(VREFIN/OUT)
N$49: C18.2 U$22.6(VSS)
N$50: U$23.P$4(C)
REF1: U$21.6(VOUT_C) X5.P$2
REF2: U$21.7(VOUT_D) X5.P$1
SCLK: U$21.12(SCLK) U$22.14(SCLK) ; also sheet 3
SDI: U$21.14(SDIN) U$22.12(SDI) ; also sheet 3
SDO: U$21.8(SDO) U$22.10(SDO) ; also sheet 3
SHUTDOWN_E_ECU: J1.2
SHUTDOWN_E_HV: Q24.3(D) X1.P$3
SHUTDOWN_E_HV_CTRL: R49.1 R59.11
SSOK1: J1.1
TEMP_SENSE: U$21.2(VOUT_B) X5.P$3
TSAL+_BTN_CTRL: R48.1 R60.4
Unconnected: $$X2.P$1 $$X2.P$6 $$X2.P$7 $$X2.P$8 Q17.3(D) R37.1 R37.2 R37.3 R37.4 R37.6 R37.7 R37.8 R37.9 R37.10 R37.11 R37.13 R37.14 R37.15 R37.16 R59.4 R59.13 R60.1 R60.2 R60.3 R60.5 R60.6 R60.7 R60.8 R60.9 R60.10 R60.11 R60.12 R60.14 R60.15 R60.16 U$22.1(ALERT) U$22.2(CLEAR) U$22.3(RESET)

## Sheet 5 of 5

## Library data of the parts
$$X1 $$X2 = HyTechDevices:CONNECTOR-8: Mini-Fit Junior connector 8 pole Source: http://www.molex.com
C1-C32 = HyTechDevices:CAP: Capacitor Standard 0603 ceramic capacitor, and 0.1" leaded capacitor.
D1-D3 D5 = HyTechDevices:DIODE: DIODE general purpose rectifier
D10 = HyTechDevices:DIODE_ZENER: ZENER DIODE
J1 J4 = HyTechDevices:JUMPER: Jumper for changing operation of a device
Q1 Q3 Q4 Q7 Q13 Q15 Q19-Q21 Q24 Q26 = HyTechDevices:P-CHANNEL_MOSFET_DMP3099L-7: Diodes Incorporated P-Channel Enhancement Mode MOSFET Datasheet <http://www.mouser.com/ds/2/115/DMP3099L-266220.pdf>
Q2 Q5 Q6 Q8-Q12 Q14 Q16-Q18 Q22 Q23 Q25 Q27 = HyTechDevices:DMG3406L: Generic NPN MOSFET DMG3406L (SOT-23, 2.8 A 30V)
R1 R3 R6 R9 R11 R13 R15 R37 R41 R59 R60 R91 R94 = HyTechDevices:YC248-JR-0710KL: 10k 8-resistor array. Replaces Bourns Cat 16 Datasheet <https://www.yageo.com/upload/media/product/productsearch/datasheet/rchip/PYu-YC_TC_group_51_RoHS_L_9.pdf>; BUILT_BY: EMA_UL_Team; MANUFACTURER_PART_NUMBER: YC248-JR-0710KL; VENDOR: Yageo
R2 R4 R5 R7 R8 R10 R12 R14 R16-R36 R38-R40 R42-R58 R61-R90 R92 R93 R95 R96 R131 = HyTechDevices:RESISTOR: Resistor Basic schematic elements and footprints for 0603, 1206, and PTH resistors.
U2 = HyTechDevices:AD5263: AD5263 Digital Potentiometer Datasheet <https://www.analog.com/media/en/technical-documentation/data-sheets/AD5263.pdf>
U$2 = HyTechDevices:MCP2551: MCP2551 High-Speed CAN Transceiver Product Webpage <https://www.microchip.com/wwwproducts/en/MCP2551> Datasheet <http://ww1.microchip.com/downloads/en/DeviceDoc/21667f.pdf> This device is outdated It is replaced by MCP2561. Comparison Page <https://www.microchip.com/wwwproducts/ProductCompare/MCP2551/MCP2561> Product Webpage <https://www.microchip.com/wwwproducts/en/MCP2561> Datasheet <http://ww1.microchip.com/downloads/en/DeviceDoc/20005167C.pdf>
U$3 = HyTechDevices:OKI-78SR-5: Murata OKI-78SR 5V 1.5A Non-Isolated Switching Regulator DC/DC - Datasheet <https://power.murata.com/data/power/oki-78sr.pdf>
U$4-U$7 U$11 U$12 U$20 U$23 U$24 = HyTechDevices:MMBZ5245BTS-7-F: 15V Zener Diode Array 3 Independent with SOT363 footprint. Datasheet <https://www.mouser.com/datasheet/2/115/ds30184-1382386.pdf>; VOLTAGE: 15V
U$8 U$21 = HyTechDevices:AD5684R: AD5684 4-channel DAC 5V, 12-bit resolution Datasheet <https://www.analog.com/media/en/technical-documentation/data-sheets/AD5686_5684.pdf>
U$9 U$22 = HyTechDevices:AD5721R: AD5721 Digital to Analog Converter 12-bit resolution Datasheet <https://www.analog.com/media/en/technical-documentation/data-sheets/ad5761_5721.pdf>
U$10 = HyTechDevices:TEENSY_3.5_EXT: Simple version of the Teensy 3.5 board that only uses the 2 main rows of pins, plus the perpendicular row with VBat.
U$13 U$19 U$26 U$28 = HyTechDevices:NE5532: TI NE5532 Dual Channel Op Amp
U$15 U$25 U$27 U$29 = HyTechDevices:NA555: Texas Instruments NA555 timer. Data sheet <http://www.ti.com/lit/ds/symlink/se555.pdf>
X1 X3 = HyTechDevices:CONNECTOR-6: Mini-Fit Junior connector 6 pole Source: http://www.molex.com
X4 X5 = HyTechDevices:CONNECTOR-4: Mini-Fit Junior connector 4 pole Source: http://www.molex.com